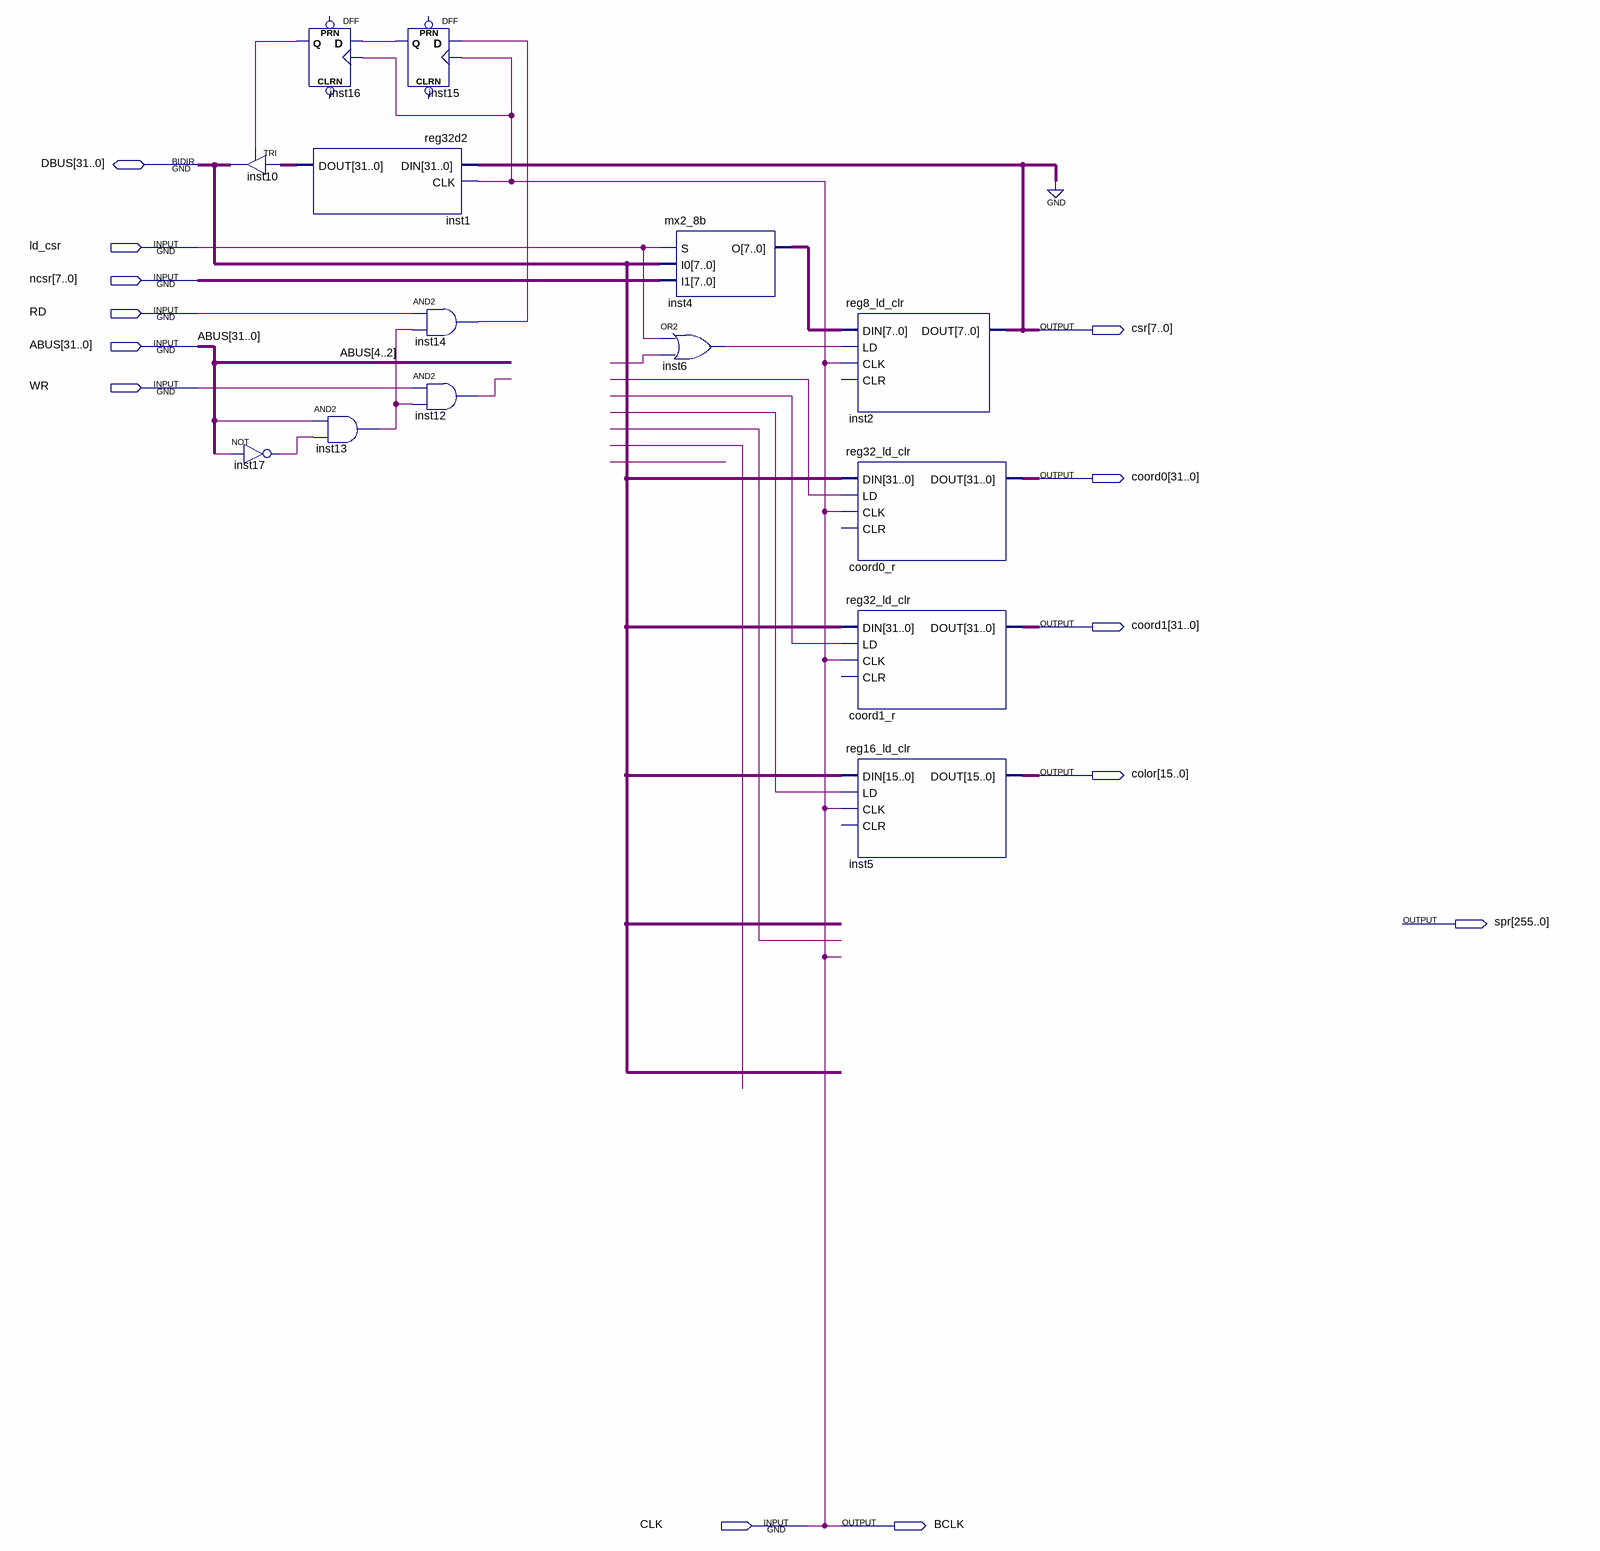
[diagram p0: schematic sheet]
// Quartus schematic bif_old.bdf as structural Verilog: 14 symbols, 13 pins
module bif_old (
  input  ld_csr,
  input  [7:0] ncsr,
  input  RD,
  input  [31:0] ABUS,
  input  WR,
  input  CLK,
  inout  [31:0] DBUS,
  output [7:0] csr,
  output [31:0] coord0,
  output [31:0] coord1,
  output [15:0] color,
  output [255:0] spr,
  output BCLK
);

  wire inst6_out, inst12_out, inst13_out, inst14_out, inst15_q, inst16_q, inst17_out, undriven, undriven_2,
       undriven_3, undriven_4;
  wire [7:0] inst4_o;
  wire [31:0] inst1_dout;

  TRI inst10[31:0] (.IN(inst1_dout), .OE(inst16_q), .OUT(DBUS));
  not inst17 (inst17_out, ABUS[31]);
  DFF inst16 (.CLK(CLK), .D(inst15_q), .Q(inst16_q));  // open: CLRN, PRN
  reg32d2 inst1 (.DIN({{24{1'b0}}, csr}), .CLK(CLK), .DOUT(inst1_dout));
  and inst13 (inst13_out, ABUS[30], inst17_out);
  DFF inst15 (.CLK(CLK), .D(inst14_out), .Q(inst15_q));  // open: CLRN, PRN
  and inst14 (inst14_out, RD, inst13_out);
  and inst12 (inst12_out, WR, inst13_out);
  mx2_8b inst4 (.S(ld_csr), .I0(DBUS[7:0]), .I1(ncsr), .O(inst4_o));
  or inst6 (inst6_out, ld_csr, undriven);
  reg8_ld_clr inst2 (.DIN(inst4_o), .LD(inst6_out), .CLK(CLK), .DOUT(csr));  // open: CLR
  reg32_ld_clr coord0_r (.DIN(DBUS), .LD(undriven_2), .CLK(CLK), .DOUT(coord0));  // open: CLR
  reg32_ld_clr coord1_r (.DIN(DBUS), .LD(undriven_3), .CLK(CLK), .DOUT(coord1));  // open: CLR
  reg16_ld_clr inst5 (.DIN(DBUS[15:0]), .LD(undriven_4), .CLK(CLK), .DOUT(color));  // open: CLR

  assign BCLK = CLK;
endmodule
